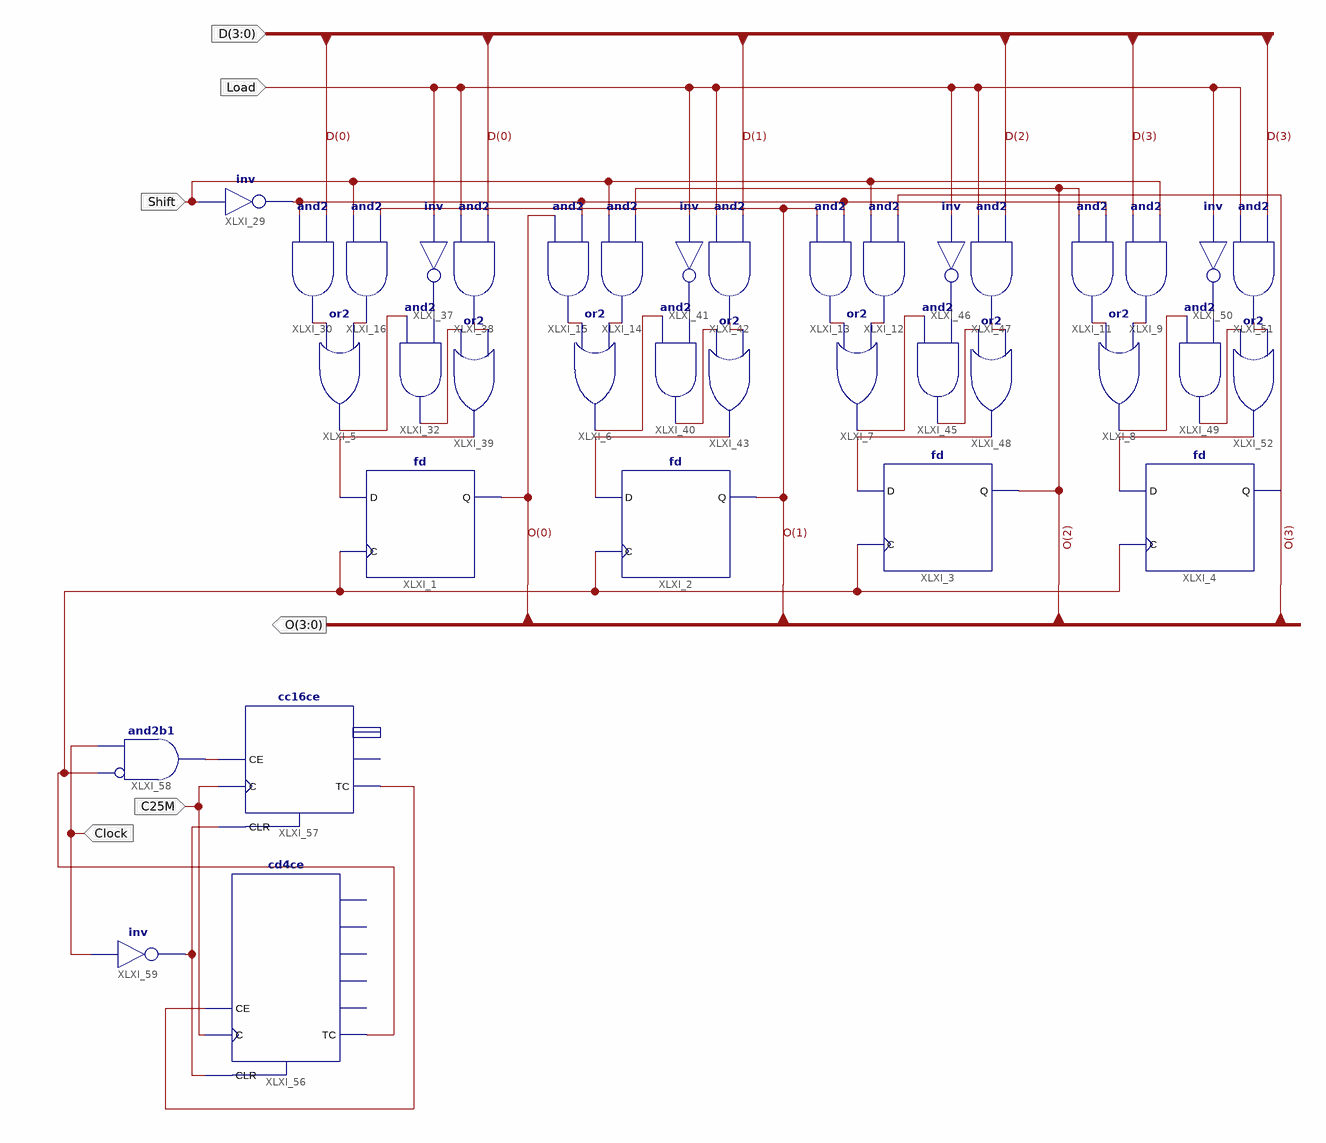
[diagram p0: schematic sheet 1]
// Xilinx ISE schematic sch.sch (spartan3e) as structural Verilog: 37 symbols, 6 ports
module sch (
  input  Clock,
  input  [3:0] D,
  input  Shift,
  input  Load,
  input  C25M,
  output [3:0] O
);

  wire XLXN_1, XLXN_2, XLXN_4, XLXN_5, XLXN_8, XLXN_9, XLXN_10, XLXN_11, XLXN_57, XLXN_63, XLXN_66, XLXN_68,
       XLXN_69, XLXN_70, XLXN_71, XLXN_72, XLXN_73, XLXN_74, XLXN_75, XLXN_78, XLXN_79, XLXN_80, XLXN_81,
       XLXN_82, XLXN_83, XLXN_84, XLXN_85, XLXN_89, XLXN_90, XLXN_93, XLXN_94, XLXN_95, XLXN_100;

  or XLXI_6 (XLXN_74, XLXN_4, XLXN_5);
  or XLXI_7 (XLXN_89, XLXN_9, XLXN_8);
  or XLXI_8 (XLXN_84, XLXN_10, XLXN_11);
  and XLXI_9 (XLXN_11, D[3], Shift);
  and XLXI_11 (XLXN_10, O[2], XLXN_57);
  and XLXI_12 (XLXN_8, Shift, O[3]);
  and XLXI_13 (XLXN_9, O[1], XLXN_57);
  and XLXI_14 (XLXN_5, Shift, O[2]);
  and XLXI_15 (XLXN_4, O[0], XLXN_57);
  and XLXI_16 (XLXN_2, Shift, O[1]);
  not XLXI_29 (XLXN_57, Shift);
  and XLXI_30 (XLXN_1, XLXN_57, D[0]);
  and XLXI_32 (XLXN_68, XLXN_63, XLXN_66);
  fd XLXI_1 (.C(XLXN_100), .D(XLXN_70), .Q(O[0]));
  or XLXI_5 (XLXN_63, XLXN_1, XLXN_2);
  not XLXI_37 (XLXN_66, Load);
  and XLXI_38 (XLXN_69, Load, D[0]);
  or XLXI_39 (XLXN_70, XLXN_68, XLXN_69);
  and XLXI_40 (XLXN_72, XLXN_74, XLXN_71);
  not XLXI_41 (XLXN_71, Load);
  and XLXI_42 (XLXN_73, Load, D[1]);
  or XLXI_43 (XLXN_75, XLXN_72, XLXN_73);
  fd XLXI_2 (.C(XLXN_100), .D(XLXN_75), .Q(O[1]));
  and XLXI_45 (XLXN_79, XLXN_89, XLXN_78);
  not XLXI_46 (XLXN_78, Load);
  and XLXI_47 (XLXN_80, Load, D[2]);
  or XLXI_48 (XLXN_90, XLXN_79, XLXN_80);
  and XLXI_49 (XLXN_82, XLXN_84, XLXN_81);
  not XLXI_50 (XLXN_81, Load);
  and XLXI_51 (XLXN_83, Load, D[3]);
  or XLXI_52 (XLXN_85, XLXN_82, XLXN_83);
  fd XLXI_3 (.C(XLXN_100), .D(XLXN_90), .Q(O[2]));
  fd XLXI_4 (.C(XLXN_100), .D(XLXN_85), .Q(O[3]));
  cd4ce XLXI_56 (.C(C25M), .CE(XLXN_94), .CLR(XLXN_93), .TC(XLXN_100));  // open: CEO, Q0, Q1, Q2, Q3
  cc16ce XLXI_57 (.C(C25M), .CE(XLXN_95), .CLR(XLXN_93), .TC(XLXN_94));  // open: CEO, Q
  and XLXI_58 (XLXN_95, ~XLXN_100, Clock);  // and2b1
  not XLXI_59 (XLXN_93, Clock);
endmodule
